# EAGLE design jit_pcb_smd (EAGLE 6.6.0)
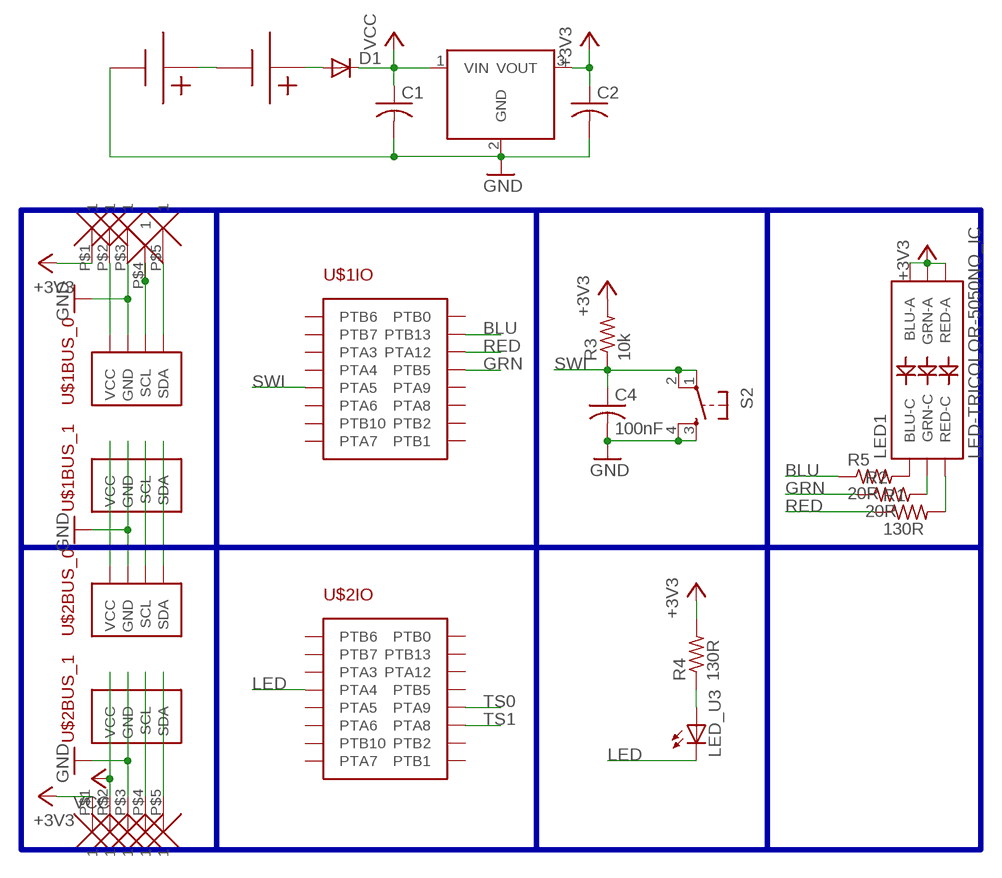
[diagram p0: schematic, sheet 1]

## Parts
C1  C-USC0805  [C0805]
C2  C-USC0805  [C0805]
C4  100nF  C-USC0805  [C0805]
D1  DIODE-SMC  [SMC]
LED1  LED-TRICOLOR-5050NO_IC  [LED-TRICOLOR-5050]
LED_U3  LEDCHIP-LED0805  [CHIP-LED0805]
R1  130R  R-US_R0805  [R0805]
R2  20R  R-US_R0805  [R0805]
R3  10k  R-US_R0805  [R0805]
R4  130R  R-US_R0805  [R0805]
R5  20R  R-US_R0805  [R0805]
S2  TAC_SWITCHSMD  [TACTILE_SWITCH_SMD]
U$1  MODROB_CARRIER-SMD  [CARRIER_SMD]
U$2  MODROB_CARRIER-SMD  [CARRIER_SMD]
U$3  CR3023  [BU2032SM-G]
U$4  CR3023  [BU2032SM-G]
U$5  TC1262  [SOT223]
U$6  1X5_SMD  [1X5_SMD]
U$7  1X5_SMD  [1X5_SMD]

## Nets
+3V3: C2.1 LED1.1(GRN-A) LED1.2(RED-A) LED1.3(BLU-A) R3.2 R4.2 U$5.3(VOUT) U$6.P$1 U$7.P$1
BLU: R5.1 U$1.PTB13(IO:PTB13)
GND: C1.2 C2.2 C4.2 S2.3 S2.4 U$1.GND_0(BUS_0:GND) U$1.GND_1(BUS_1:GND) U$2.GND_0(BUS_0:GND) U$2.GND_1(BUS_1:GND) U$3.- U$5.2(GND) U$6.P$3 U$7.P$3
GRN: R2.1 U$1.PTB5(IO:PTB5)
LED: LED_U3.C U$2.PTA4(IO:PTA4)
N$1: U$1.VCC_0(BUS_0:VCC) U$7.P$2
N$2: U$1.VCC_1(BUS_1:VCC) U$2.VCC_0(BUS_0:VCC)
N$3: U$1.SCL_0(BUS_0:SCL) U$7.P$4
N$4: LED_U3.A R4.1
N$5: U$1.SDA_0(BUS_0:SDA) U$7.P$5
N$7: U$1.SCL_1(BUS_1:SCL) U$2.SCL_0(BUS_0:SCL)
N$8: U$1.SDA_1(BUS_1:SDA) U$2.SDA_0(BUS_0:SDA)
N$9: U$2.SCL_1(BUS_1:SCL) U$6.P$4
N$10: U$2.SDA_1(BUS_1:SDA) U$6.P$5
N$11: LED1.4(BLU-C) R5.2
N$12: LED1.5(RED-C) R1.2
N$13: U$3.+ U$4.-
N$14: LED1.6(GRN-C) R2.2
N$15: D1.A U$4.+
RED: R1.1 U$1.PTA12(IO:PTA12)
SWI: C4.1 R3.1 S2.1 S2.2 U$1.PTA5(IO:PTA5)
TS0: U$2.PTA9(IO:PTA9)
TS1: U$2.PTA8(IO:PTA8)
VCC: C1.1 D1.C U$2.VCC_1(BUS_1:VCC) U$5.1(VIN) U$6.P$2
Unconnected: U$1.PTA3(IO:PTA3) U$1.PTA4(IO:PTA4) U$1.PTA6(IO:PTA6) U$1.PTA7(IO:PTA7) U$1.PTA8(IO:PTA8) U$1.PTA9(IO:PTA9) U$1.PTB0(IO:PTB0) U$1.PTB1(IO:PTB1) U$1.PTB2(IO:PTB2) U$1.PTB6(IO:PTB6) U$1.PTB7(IO:PTB7) U$1.PTB10(IO:PTB10) U$2.PTA3(IO:PTA3) U$2.PTA5(IO:PTA5) U$2.PTA6(IO:PTA6) U$2.PTA7(IO:PTA7) U$2.PTA12(IO:PTA12) U$2.PTB0(IO:PTB0) U$2.PTB1(IO:PTB1) U$2.PTB2(IO:PTB2) U$2.PTB5(IO:PTB5) U$2.PTB6(IO:PTB6) U$2.PTB7(IO:PTB7) U$2.PTB10(IO:PTB10) U$2.PTB13(IO:PTB13)

## Buses
B$1

## Library data of the parts
C1 C2 C4 = rcl:C-US: CAPACITOR, American symbol
D1 = diode:DIODE-: DIODE
LED1 = SparkFun-LED:LED-TRICOLOR-5050
LED_U3 = led:LED: LED OSRAM: - CHIPLED LG R971, LG N971, LY N971, LG Q971, LY Q971, LO R971, LY R971 LH N974, LH R974 LS Q976, LO Q976, LY Q976 LO Q996 - Hyper CHIPLED LW Q18S LB Q993, LB Q99A, LB R99A - SideLED LS A670, LO A670, LY A670, LG A670, LP A670 LB A673, LV A673, LT A673, LW A673 LH A674 LY A675 LS A676, LA A676, LO A676, LY A676, LW A676 LS A679, LY A679, LG A679 - Hyper Micro SIDELED® LS Y876, LA Y876, LO Y876, LY Y876 LT Y87S - SmartLED LW L88C, LW L88S LB L89C, LB L89S, LG L890 LS L89K, LO L89K, LY L89K LS L896, LA L896, LO L896, LY L896 - TOPLED LS T670, LO T670, LY T670, LG T670, LP T670 LSG T670, LSP T670, LSY T670, LOP T670, LYG T670 LG T671, LOG T671, LSG T671 LB T673, LV T673, LT T673, LW T673 LH T674 LS T676, LA T676, LO T676, LY T676, LB T676, LH T676, LSB T676, LW T676 LB T67C, LV T67C, LT T67C, LS T67K, LO T67K, LY T67K, LW E67C LS E67B, LA E67B, LO E67B, LY E67B, LB E67C, LV E67C, LT E67C LW T67C LS T679, LY T679, LG T679 LS T770, LO T770, LY T770, LG T770, LP T770 LB T773, LV T773, LT T773, LW T773 LH T774 LS E675, LA E675, LY E675, LS T675 LS T776, LA T776, LO T776, LY T776, LB T776 LHGB T686 LT T68C, LB T68C - Hyper Mini TOPLED® LB M676 - Mini TOPLED Santana® LG M470 LS M47K, LO M47K, LY M47K Source: http://www.osram.convergy.de LUXEON: - LUMILED® LXK2-PW12-R00, LXK2-PW12-S00, LXK2-PW14-U00, LXK2-PW14-V00 LXK2-PM12-R00, LXK2-PM12-S00, LXK2-PM14-U00 LXK2-PE12-Q00, LXK2-PE12-R00, LXK2-PE12-S00, LXK2-PE14-T00, LXK2-PE14-U00 LXK2-PB12-K00, LXK2-PB12-L00, LXK2-PB12-M00, LXK2-PB14-N00, LXK2-PB14-P00, LXK2-PB14-Q00 LXK2-PR12-L00, LXK2-PR12-M00, LXK2-PR14-Q00, LXK2-PR14-R00 LXK2-PD12-Q00, LXK2-PD12-R00, LXK2-PD12-S00 LXK2-PH12-R00, LXK2-PH12-S00 LXK2-PL12-P00, LXK2-PL12-Q00, LXK2-PL12-R00 Source: www.luxeon.com KINGBRIGHT: KA-3528ASYC Source: www.kingbright.com
R1-R5 = rcl:R-US_: RESISTOR, American symbol
S2 = SparkFun-Electromechanical:TAC_SWITCH: Momentary Switch Button commonly used for reset or general input. Spark Fun Electronics SKU : COM-00097 SMT- SWCH-08247; PROD_ID: SWCH-08247
U$1 U$2 = modular_robotics:MODROB_CARRIER
U$3 U$4 = modular_robotics:CR3023
U$5 = modular_robotics:TC1262
U$6 U$7 = modular_robotics:1X5_SMD

## Board
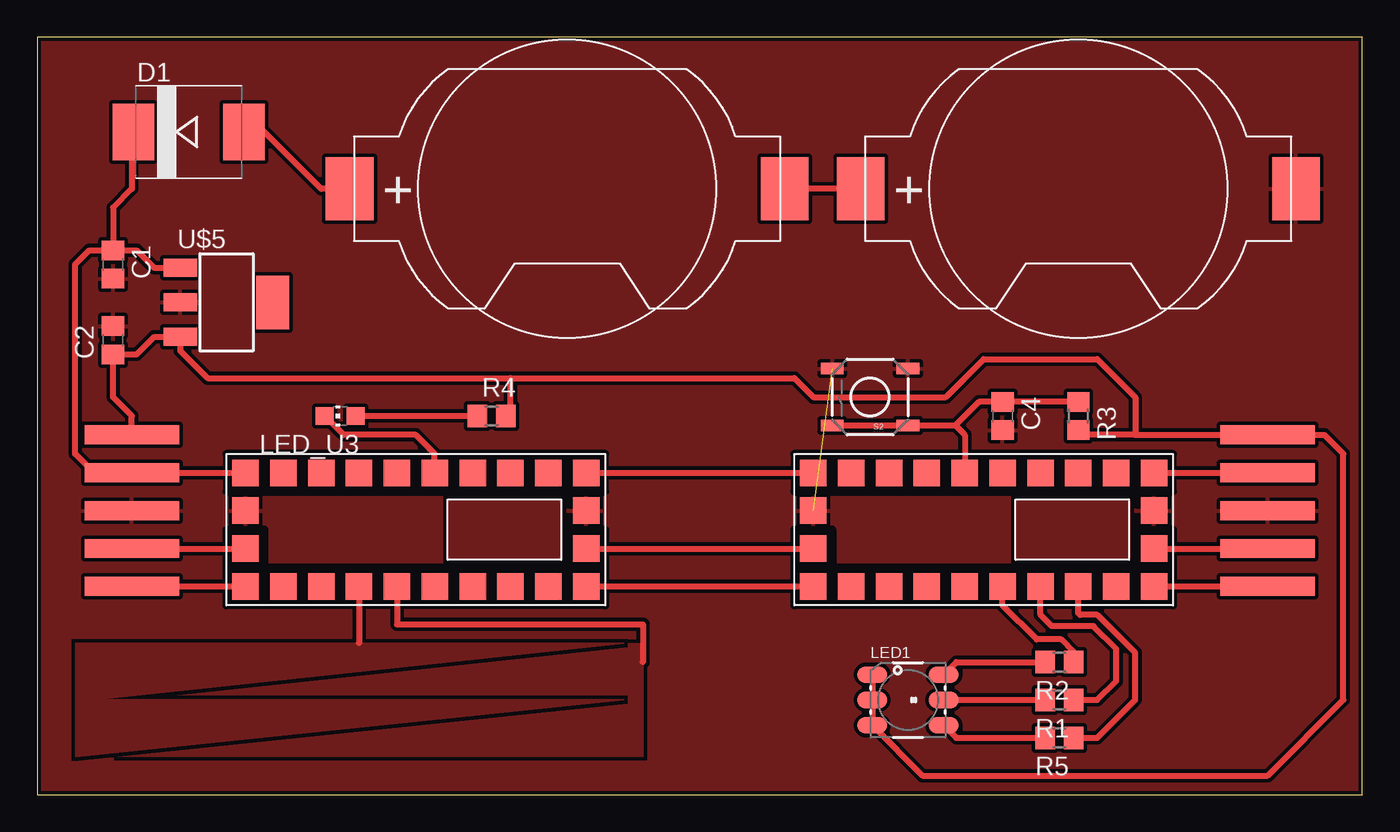
[diagram p1: board, top side]
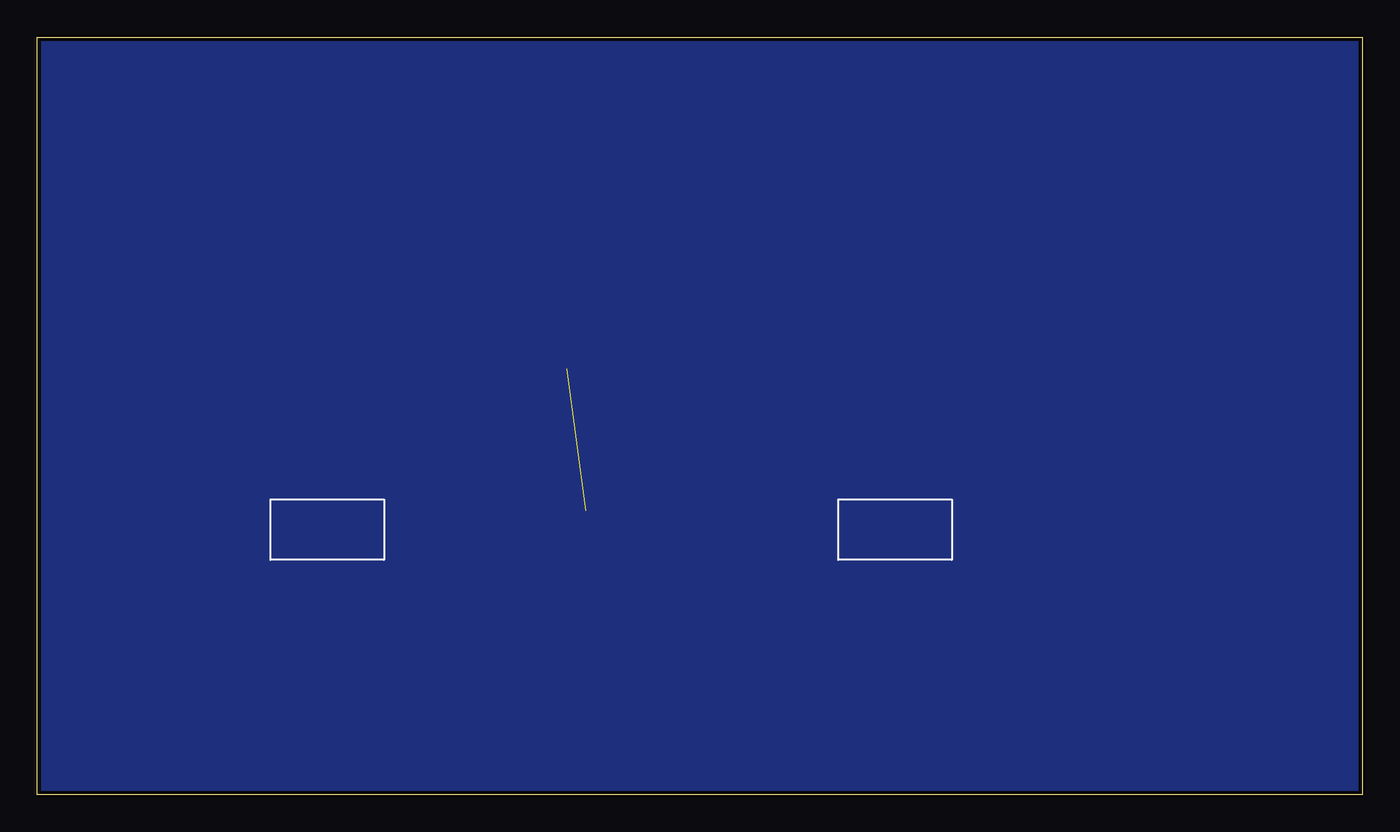
[diagram p2: board, bottom side, seen from below]

Size 88.9 x 50.8 mm. Coordinates in mm from the lower left corner, seen from the top.
Outline: 0,50.8 0,0 88.9,0 88.9,50.8 0,50.8
Copper layers (1*16): Top 0.035mm / dielectric 1.5mm / Bottom 0.035mm
Design rules "default *": minimum track width 10mil, minimum drill 24mil, track to track 10mil, track to pad 10mil, pad to pad 10mil, via to via 10mil, smd to smd 10mil, copper to edge 10mil, drill to drill 8mil, minimum pad ring 5mil, minimum via ring 10mil, stop-mask expansion 4mil, vias tented up to drill 0mil, thermal gap 10mil
tRestrict: area 12.7,12.7 to 38.1,17.8; area 12.7,20.3 to 38.1,22.9; area 50.8,20.3 to 76.2,22.9; area 50.8,12.7 to 76.2,17.8

### Footprints (pad centres in the part's own frame; a part is rotated, then mirrored left to right if it is on the bottom)
C0805 = smd 1.3 x 1.5: 1 -0.95,0; 2 0.95,0
SMC = smd 2.8 x 3.8: A 3.7,0; C -3.7,0
LED-TRICOLOR-5050 = smd 2 x 1.1: 1 -2.4,1.7; 2 -2.4,0; 3 -2.4,-1.7; 4 2.4,-1.7; 5 2.4,0; 6 2.4,1.7
CHIP-LED0805 = smd 1.2 x 1.2: A 0,-1.05; C 0,1.05
R0805 = smd 1.3 x 1.5: 1 -0.95,0; 2 0.95,0
TACTILE_SWITCH_SMD = smd 1.524 x 0.762: 1 -2.54,1.905; 2 2.54,1.905; 3 -2.54,-1.905; 4 2.54,-1.905
CARRIER_SMD = smd 1.778 x 1.778: GND_0 -11.43,-1.27; GND_1 11.43,-1.27; PTA3 -3.81,-3.81; PTA4 -1.27,-3.81; PTA5 1.27,-3.81; PTA6 3.81,-3.81; PTA7 8.89,-3.81; PTA8 3.81,3.81; PTA9 1.27,3.81; PTA12 -3.81,3.81; PTB0 -8.89,3.81; PTB1 8.89,3.81; PTB2 6.35,3.81; PTB5 -1.27,3.81; PTB6 -8.89,-3.81; PTB7 -6.35,-3.81; PTB10 6.35,-3.81; PTB13 -6.35,3.81; SCL_0 -11.43,1.27; SCL_1 11.43,1.27; SDA_0 -11.43,3.81; SDA_1 11.43,3.81; VCC_0 -11.43,-3.81; VCC_1 11.43,-3.81
BU2032SM-G = smd 3.2 x 4.2: + -14.6,0; - 14.6,0
SOT223 = smd 1.219 x 2.235: 1 -2.311,-3.099; 2 0,-3.099; 3 2.311,-3.099 | smd 3.6 x 2.2: 4 0,3.099
1X5_SMD = smd 6.35 x 1.27: P$1 0,0; P$2 0,2.54; P$3 0,5.08; P$4 0,7.62; P$5 0,10.16

### Placement (x,y rotation side)
C1  5.08,35.56 270 top
C2  5.08,30.48 90 top
C4  64.77,25.4 270 top
D1  10.16,44.45 0 top
LED1  58.42,6.35 0 top
LED_U3  20.32,25.4 90 top
R1  68.58,6.35 180 top
R2  68.58,8.89 180 top
R3  69.85,25.4 270 top
R4  30.48,25.4 0 top
R5  68.58,3.81 180 top
S2  55.88,26.67 180 top
U$1  63.5,17.78 180 top
U$2  25.4,17.78 180 top
U$3  69.85,40.64 0 top
U$4  35.56,40.64 0 top
U$5  12.7,33.02 270 top
U$6  6.35,24.13 180 top
U$7  82.55,24.13 180 top

### Tracks (layer width: path | path; a pad name or v marks a point on that pad's centre or on a via)
+3V3
  Top 0.406: U$6.P$1 6.35,25.4 5.08,26.67 C2.1 6.67,29.53 7.85,30.71 U$5.3 9.6,29.77 11.43,27.94 31.75,27.94 | 31.75,27.94 50.8,27.94 52.07,26.67 60.96,26.67 63.5,29.21 71.12,29.21 73.66,26.67 73.66,24.13 | R4.2 31.75,25.72 31.75,27.94 | 73.66,24.13 U$7.P$1 86.36,24.13 87.63,22.86 87.63,6.35 82.55,1.27 59.4,1.27 LED1.3 LED1.2 LED1.1 | 73.66,24.13 70.17,24.13 R3.2
BLU
  Top 0.406: R5.1 71.12,3.81 73.66,6.35 73.66,9.53 71.12,12.06 69.98,12.06 69.85,12.19 U$1.PTB13
GND  (1 unrouted)
  pour Bottom (isolate 0.127, rank 3): 0,50.8 0,0 88.9,0 88.9,50.8
  pour Top (isolate 0.254, rank 3): 0,50.8 0,0 88.9,0 88.9,50.8
GRN
  Top 0.406: 69.85,8.89 R2.1 69.53,9.59 68.71,10.41 67.06,10.41 64.77,12.7 U$1.PTB5
LED
  Top 0.406: U$2.PTA4 26.67,22.86 25.4,24.13 20.54,24.13 LED_U3.C
N$1
  Top 0.406: U$1.VCC_0 U$7.P$2
N$2
  Top 0.406: U$2.VCC_0 U$1.VCC_1
N$3
  Top 0.406: U$1.SCL_0 U$7.P$4
N$4
  Top 0.406: LED_U3.A R4.1
N$5
  Top 0.406: U$1.SDA_0 U$7.P$5
N$6
  pour Top: 27.69,15.88 27.69,19.68 35.05,19.68 35.05,15.88
N$7
  Top 0.406: U$2.SCL_0 U$1.SCL_1
N$8
  Top 0.406: U$2.SDA_0 U$1.SDA_1
N$9
  Top 0.406: U$6.P$4 U$2.SCL_1
N$10
  Top 0.406: U$6.P$5 U$2.SDA_1
N$11
  Top 0.406: LED1.4 61.66,3.81 R5.2
N$12
  Top 0.406: LED1.5 R1.2
N$13
  Top 0.406: U$3.+ U$4.- 49.53,39.37
N$14
  Top 0.406: LED1.6 61.66,8.89 R2.2
N$15
  Top 0.406: U$4.+ 19.05,40.64 13.97,45.72 13.97,44.56 D1.A
N$16
  pour Top: 65.79,15.88 65.79,19.68 73.15,19.68 73.15,15.88
RED
  Top 0.406: R1.1 71.12,6.35 72.39,7.62 72.39,9.78 70.87,11.3 68.07,11.3 67.31,12.06 U$1.PTA12
SWI
  Top 0.406: S2.2 S2.1 61.59,24.77 | 61.59,24.77 62.23,24.13 U$1.PTA5 | R3.1 C4.1 63.18,26.35 61.59,24.77
TS0
  Top 0.406: U$2.PTA9 24.13,11.43 40.64,11.43 40.64,8.89
  pour Top (isolate 0.254, rank 2): 40.64,10.16 40.64,2.54 2.54,2.54 2.54,10.16
TS1
  Top 0.406: U$2.PTA8 21.59,10.16
  pour Top (isolate 0.254): 39.37,10.16 2.54,10.16 2.54,2.54 39.37,6.35 3.81,6.35
VCC
  Top 0.406: U$2.VCC_1 U$6.P$2 3.81,21.59 2.54,22.86 2.54,35.56 3.49,36.51 C1.1 | D1.C 6.35,44.34 6.35,40.64 5.08,39.37 C1.1 | C1.1 6.67,36.51 7.85,35.33 U$5.1